# Altium schematic sheet WLC-v0.0_top.SchDoc
size A4; SheetNumber: 1; SheetTotal: 1
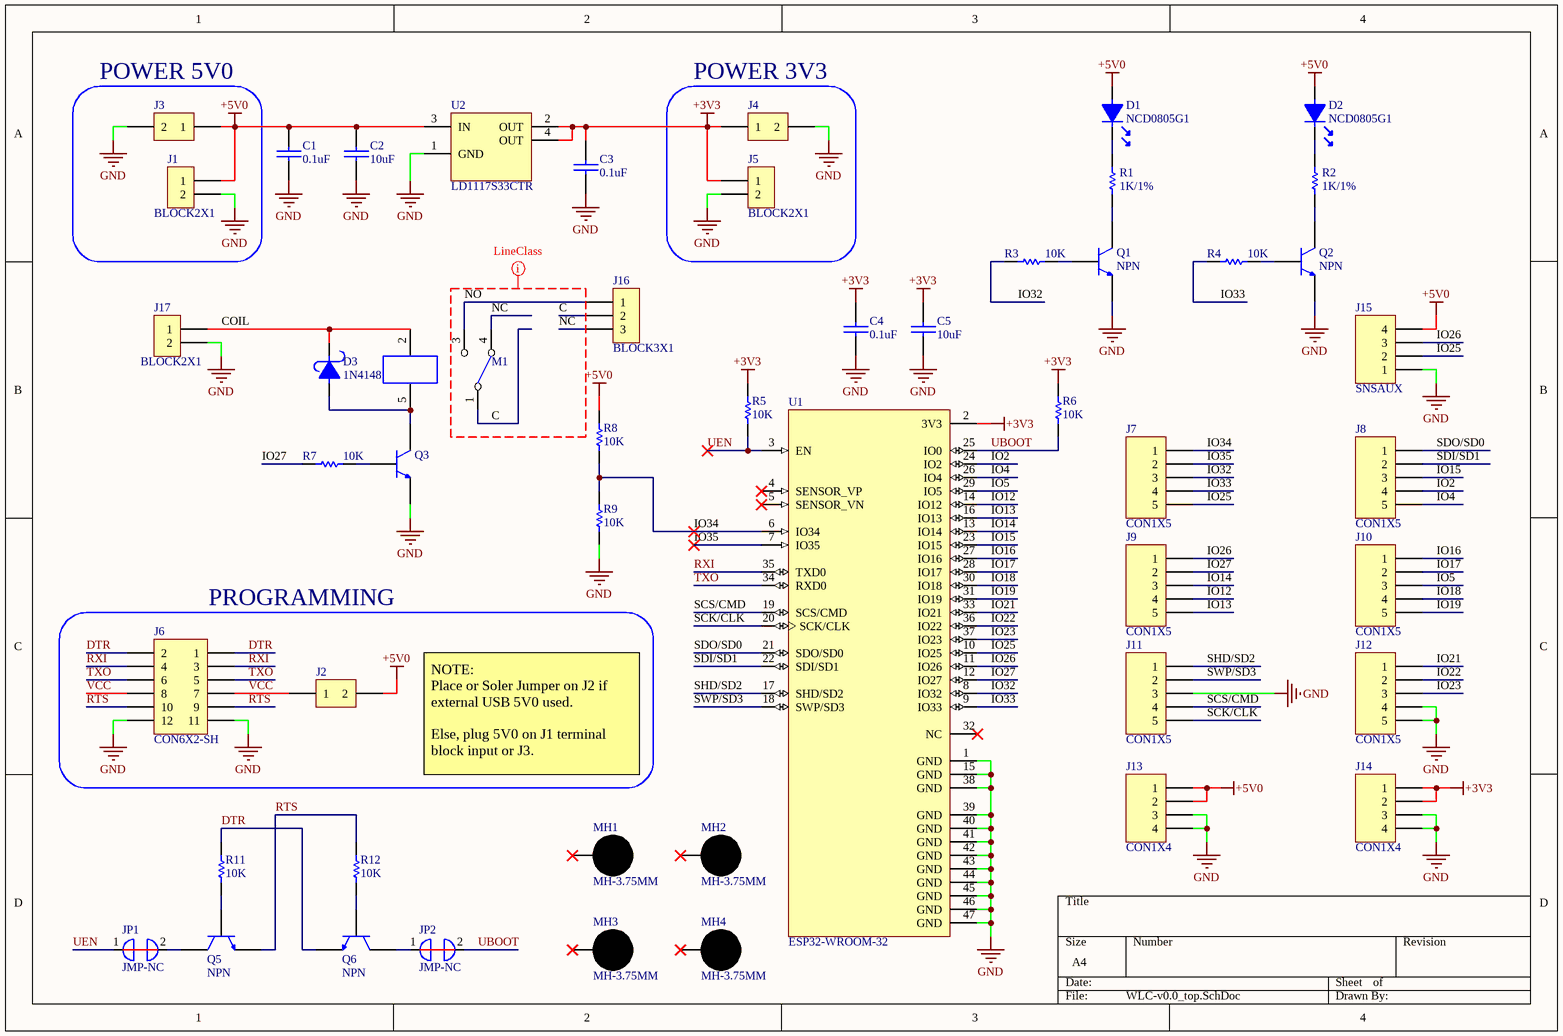
[diagram p0: WLC-v0.0_top.SchDoc]

## Parts
C1  0.1uF  [0805-CAP-TDK]
C2  10uF  [0805-CAP-TDK]
C3  0.1uF  [0805-CAP-TDK]
C4  0.1uF  [0805-CAP-TDK]
C5  10uF  [0805-CAP-TDK]
D1  NCD0805G1  [LED-0805]
D2  NCD0805G1  [LED-0805]
D3  1N4148  [DO41]
J1  BLOCK2X1  [BLOCK2]
J2  CON1X2  [SIP1X2]  (value not drawn)
J3  CON1X2  [SIP1X2]  (value not drawn)
J4  CON1X2  [SIP1X2]  (value not drawn)
J5  BLOCK2X1  [BLOCK2]
J6  CON6X2-SH  [SIP6X2-SH]
J7  CON1X5  [SIP1X5]
J8  CON1X5  [SIP1X5]
J9  CON1X5  [SIP1X5]
J10  CON1X5  [SIP1X5]
J11  CON1X5  [SIP1X5]
J12  CON1X5  [SIP1X5]
J13  CON1X4  [SIP1X4]
J14  CON1X4  [SIP1X4]
J15  SNSAUX  [SIP1X4]
J16  BLOCK3X1  [BLOCK3]
J17  BLOCK2X1  [BLOCK2]
JP1  JMP-NC  [JUMPNC]
JP2  JMP-NC  [JUMPNC]
M1  RELE SIMPLE  [HRJ-3FF-Form-C]  (value not drawn)
MH1  MH-3.75MM  [MH-3.75mm-NP]  (no BOM)
MH2  MH-3.75MM  [MH-3.75mm-NP]  (no BOM)
MH3  MH-3.75MM  [MH-3.75mm-NP]  (no BOM)
MH4  MH-3.75MM  [MH-3.75mm-NP]  (no BOM)
Q1  NPN  [TO92]
Q2  NPN  [TO92]
Q3  (no value)  [TO92]
Q5  NPN  [TO92]
Q6  NPN  [TO92]
R1  1K/1%  [0805-RES-PANASONIC]
R2  1K/1%  [0805-RES-PANASONIC]
R3  10K  [0805-RES-PANASONIC]
R4  10K  [0805-RES-PANASONIC]
R5  10K  [0805-RES-PANASONIC]
R6  10K  [0805-RES-PANASONIC]
R7  10K  [0805-RES-PANASONIC]
R8  10K  [0805-RES-PANASONIC]
R9  10K  [0805-RES-PANASONIC]
R11  10K  [0805-RES-PANASONIC]
R12  10K  [0805-RES-PANASONIC]
U1  ESP32-WROOM-32  [ESP32-WROOM-32]
U2  LD1117S33CTR  [SOT223-ST]

## Blocks framed on the sheet
POWER 5V0: J1 J3
POWER 3V3: J4 J5
PROGRAMMING: J2 J6

## Nets
+3V3: C3.2 C4.2 C5.2 J4.1 J5.1 J14.1 J14.2 R5.1 R6.1 U1.2(3V3) U2.2(OUT) U2.4(OUT)
+5V0: C1.2 C2.2 D1.1 D2.1 J1.1 J2.2 J3.1 J13.1 J13.2 J15.4 R8.2 U2.3(IN)
GND: C1.1 C2.1 C3.1 C4.1 C5.1 J1.2 J3.2 J4.2 J5.2 J6.11 J6.12 J11.3 J12.4 J12.5 J13.3 J13.4 J14.3 J14.4 J15.1 J17.2 Q1.3(E) Q2.3(E) Q3.3(E) R9.1 U1.1(GND) U1.15(GND) U1.38(GND) U1.39(GND) U1.40(GND) U1.41(GND) U1.42(GND) U1.43(GND) U1.44(GND) U1.45(GND) U1.46(GND) U1.47(GND) U2.1(GND)
C: J16.2 M1.1(C1)
COIL: D3.2 J17.1 M1.2(B1)
DTR: J6.1 J6.2 Q6.3(E) R11.1
IO2: J8.4 U1.24(IO2)
IO4: J8.5 U1.26(IO4)
IO5: J10.3 U1.29(IO5)
IO12: J9.4 U1.14(IO12)
IO13: J9.5 U1.16(IO13)
IO14: J9.3 U1.13(IO14)
IO15: J8.3 U1.23(IO15)
IO16: J10.1 U1.27(IO16)
IO17: J10.2 U1.28(IO17)
IO18: J10.4 U1.30(IO18)
IO19: J10.5 U1.31(IO19)
IO21: J12.1 U1.33(IO21)
IO22: J12.2 U1.36(IO22)
IO23: J12.3 U1.37(IO23)
IO25: J7.5 J15.2 U1.10(IO25)
IO26: J9.1 J15.3 U1.11(IO26)
IO27: J9.2 R7.1 U1.12(IO27)
IO32: J7.3 R3.2 U1.8(IO32)
IO33: J7.4 R4.2 U1.9(IO33)
IO34: J7.1 R8.1 R9.2 U1.6(IO34)
IO35: J7.2 U1.7(IO35)
NC: J16.3 M1.4(NC1)
NO: J16.1 M1.3(NA1)
RTS: J6.9 J6.10 Q5.3(E) R12.1
RXI: J6.3 J6.4 U1.35(TXD0)
SCK/CLK: J11.5 U1.20(SCK/CLK)
SCS/CMD: J11.4 U1.19(SCS/CMD)
SDI/SD1: J8.2 U1.22(SDI/SD1)
SDO/SD0: J8.1 U1.21(SDO/SD0)
SHD/SD2: J11.1 U1.17(SHD/SD2)
SWP/SD3: J11.2 U1.18(SWP/SD3)
TXO: J6.5 J6.6 U1.34(RXD0)
UBOOT: JP2.2(IN2) R6.2 U1.25(IO0)
UEN: JP1.1(IN1) R5.2 U1.3(EN)
VCC: J2.1 J6.7 J6.8
NetD1_2: D1.2 R1.2
NetD2_2: D2.2 R2.2
NetD3_1: D3.1 M1.5(B2) Q3.2(C)
NetJP1_2: JP1.2(IN2) Q5.2(C)
NetJP2_1: JP2.1(IN1) Q6.2(C)
NetQ1_1: Q1.1(B) R3.1
NetQ1_2: Q1.2(C) R1.1
NetQ2_1: Q2.1(B) R4.1
NetQ2_2: Q2.2(C) R2.1
NetQ3_1: Q3.1(B) R7.2
NetQ5_1: Q5.1(B) R11.2
NetQ6_1: Q6.1(B) R12.2

Not connected (* = marked no-connect by the designer): MH1 1*; MH2 1*; MH3 1*; MH4 1*; U1 4(SENSOR_VP)* 5(SENSOR_VN)* 32(NC)*

## Layout directives
net class LINE: C, NC, NO

## Notes on the sheet
- NOTE:
  Place or Soler Jumper on J2 if external USB 5V0 used.
  Else, plug 5V0 on J1 terminal block input or J3.

## Library data of the parts
C1-C5 = CAP-SMD
  C1 C3 C4: JLCPart: C307331
  C2 C5: JLCPart: C96446
D1 D2 = NCD0805G1: Green 65mW 0805 Light Emitting Diodes (LED); JLCPart: C84260
D3 = 1N4148: 100V 500mW 1V@10mA 4ns 200mA DO-35  Switching Diode; JLCPart: C258182
J6 = CON6X2-SH: Connector Header Through Hole 12 position 0.100" (2.54mm)
J15 = CON1X4
JP1 JP2 = JMP-NC: Jumper Pad NC
Q1-Q3 Q5 Q6 = NPN TRANSISTOR
R1-R9 R11 R12 = RES-SMD
  R1 R2: JLCPart: C11702
  R3-R9 R11 R12: JLCPart: C25744
U1 = ESP32-WROOM-32: Bluetooth, WiFi 802.11b/g/n, Bluetooth v4.2 +EDR, Class 1, 2 and 3 Transceiver Module 2.4GHz ~ 2.5GHz Antenna Not Included, U.FL Surface Mount
U2 = LD1117S33CTR: Linear Voltage Regulator IC 3V3 Positive Fixed 1 Output 800mA SOT-223; Digikey_PN: 497-1241-1-ND; JLCPart: C35879
MH1-MH4 = MH-3.75MM: ClassName: MountHole